# Altium schematic sheet DualLEDDriver.SchDoc
size A; SheetNumber: 2; SheetTotal: 2; SPICEModelCacheRFRFCTWC: <root> / <DocumentId>RFRFCTWC</DocumentId> / <CacheFrame Number="0"> / <Model Name="cap" Kind="MDL"> / <Text>*Default semiconductor capacitor / .MODEL CAP C()</Text> / </Model> / </CacheFrame> / </root>
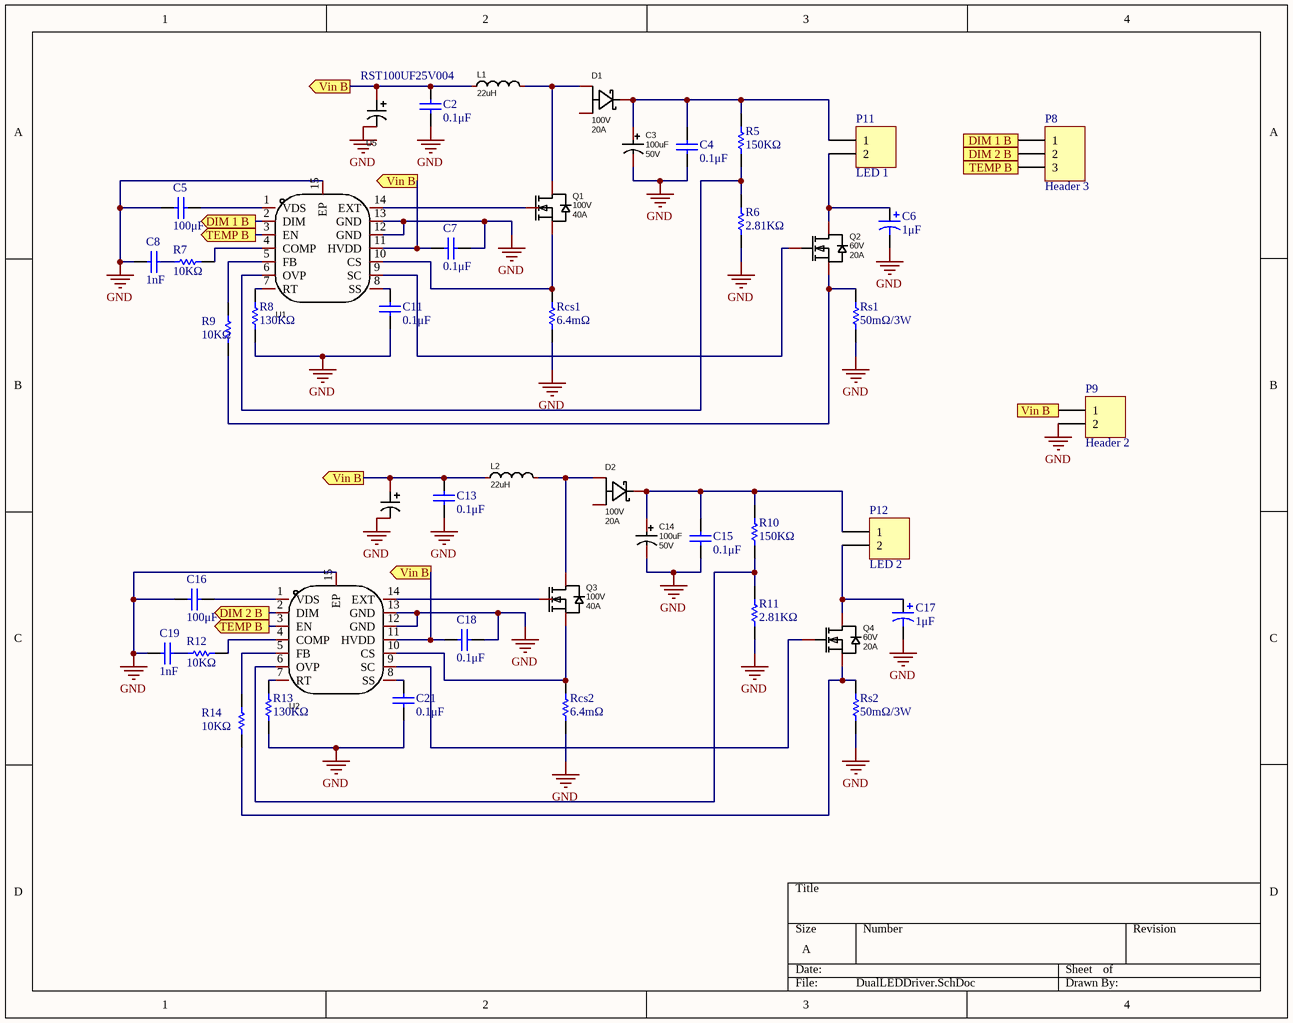
[diagram p0: DualLEDDriver.SchDoc]

## Parts
C2  value 0.1μF  [C0805]  (hidden comment: Cap)
C3  value 100uF  Rated Voltage: 50V  [CAP-TH_BD8.0-P3.50-D0.6-FD]  (hidden comment: KM107M050F12RR0VH2FP0)
C4  value 0.1μF  [C0805]  (hidden comment: Cap)
C5  value 100μF  [C0805]  (hidden comment: Cap)
C6  value 1μF  [C0805]  (hidden comment: Cap Pol3)
C7  value 0.1μF  [C0805]  (hidden comment: Cap)
C8  value 1nF  [C0805]  (hidden comment: Cap)
C11  value 0.1μF  [C0805]  (hidden comment: Cap)
C13  value 0.1μF  [C0805]  (hidden comment: Cap)
C14  value 100uF  Rated Voltage: 50V  [CAP-TH_BD8.0-P3.50-D0.6-FD]  (hidden comment: KM107M050F12RR0VH2FP0)
C15  value 0.1μF  [C0805]  (hidden comment: Cap)
C16  value 100μF  [C0805]  (hidden comment: Cap)
C17  value 1μF  [C0805]  (hidden comment: Cap Pol3)
C18  value 0.1μF  [C0805]  (hidden comment: Cap)
C19  value 1nF  [C0805]  (hidden comment: Cap)
C21  value 0.1μF  [C0805]  (hidden comment: Cap)
D1  Reverse Voltage (Vr): 100V  Average Rectified Current (Io): 20A  [TO-277_3P-L5.7-W4.2-LS6.5-BR]  (hidden comment: ST20100L)
D2  Reverse Voltage (Vr): 100V  Average Rectified Current (Io): 20A  [TO-277_3P-L5.7-W4.2-LS6.5-BR]  (hidden comment: ST20100L)
L1  value 22uH  [IND-SMD_L16.5-W15.5]  (hidden comment: FEXL1513A-220M)
L2  value 22uH  [IND-SMD_L16.5-W15.5]  (hidden comment: FEXL1513A-220M)
P8  Header 3  [HDR1X3]
P9  Header 2  [HDR1X2]
P11  LED 1  [HDR1X2]
P12  LED 2  [HDR1X2]
Q1  Drain Source Voltage (Vdss): 100V  Continuous Drain Current (Id): 40A  [TO-252-2_L6.6-W6.1-P4.58-LS9.9-TL]  (hidden comment: AP40T10GH-VB)
Q2  Drain Source Voltage (Vdss): 60V  Continuous Drain Current (Id): 20A  [TO-252-2_L6.6-W6.1-P4.57-LS10.1-TL-CW]  (hidden comment: NCE6020AK)
Q3  Drain Source Voltage (Vdss): 100V  Continuous Drain Current (Id): 40A  [TO-252-2_L6.6-W6.1-P4.58-LS9.9-TL]  (hidden comment: AP40T10GH-VB)
Q4  Drain Source Voltage (Vdss): 60V  Continuous Drain Current (Id): 20A  [TO-252-2_L6.6-W6.1-P4.57-LS10.1-TL-CW]  (hidden comment: NCE6020AK)
R5  value 150KΩ  [C0805]  (hidden comment: Res1)
R6  value 2.81KΩ  [C0805]  (hidden comment: Res1)
R7  value 10KΩ  [C0805]  (hidden comment: Res1)
R8  value 130KΩ  [C0805]  (hidden comment: Res1)
R9  value 10KΩ  [C0805]  (hidden comment: Res1)
R10  value 150KΩ  [C0805]  (hidden comment: Res1)
R11  value 2.81KΩ  [C0805]  (hidden comment: Res1)
R12  value 10KΩ  [C0805]  (hidden comment: Res1)
R13  value 130KΩ  [C0805]  (hidden comment: Res1)
R14  value 10KΩ  [C0805]  (hidden comment: Res1)
Rcs1  value 6.4mΩ  [C0805]  (hidden comment: Res1)
Rcs2  value 6.4mΩ  [C0805]  (hidden comment: Res1)
Rs1  value 50mΩ/3W  [C2512]  (hidden comment: Res1)
Rs2  value 50mΩ/3W  [C2512]  (hidden comment: Res1)
U1  FP7209mR-G1  [TSSOP-14_L5.0-W4.4-P0.65-LS6.4-BL-EP]  (value not drawn)
U2  FP7209mR-G1  [TSSOP-14_L5.0-W4.4-P0.65-LS6.4-BL-EP]  (value not drawn)
U5  RST100UF25V004  [CAP-SMD_BD6.3-L6.6-W6.6-LS7.3-FD]
U6  RST100UF25V004  [CAP-SMD_BD6.3-L6.6-W6.6-LS7.3-FD]  (value not drawn)

## Ports
DIM 1 B (in), DIM 1 B (out), DIM 2 B (in), DIM 2 B (out), TEMP B (in), TEMP B (out), Vin B (out)

## Nets
GND: C2.1 C3.2 C4.1 C5.2 C6.2 C7.1 C8.2 C11.1 C13.1 C14.2 C15.1 C16.2 C17.2 C18.1 C19.2 C21.1 P9.2 R6.2 R8.1 R11.2 R13.1 Rcs1.1 Rcs2.1 Rs1.1 Rs2.1 U1.12(GND) U1.13(GND) U1.15(EP) U2.12(GND) U2.13(GND) U2.15(EP) U5.2 U6.2
DIM 1 B: P8.1 U1.2(DIM) ; port DIM 1 B
DIM 2 B: P8.2 U2.2(DIM) ; port DIM 2 B
TEMP B: P8.3 U1.3(EN) U2.3(EN) ; port TEMP B
Vin B: C2.2 C7.2 C13.2 C18.2 L1.2 L2.2 P9.1 U1.11(HVDD) U2.11(HVDD) U5.1 U6.1 ; port Vin B
NetC3_1: C3.1 C4.2 D1.2(K) P11.1 R5.2
NetC5_1: C5.1 U1.1(VDS)
NetC6_1: C6.1 P11.2 Q2.2(D)
NetC8_1: C8.1 R7.1
NetC11_2: C11.2 U1.8(SS)
NetC14_1: C14.1 C15.2 D2.2(K) P12.1 R10.2
NetC16_1: C16.1 U2.1(VDS)
NetC17_1: C17.1 P12.2 Q4.2(D)
NetC19_1: C19.1 R12.1
NetC21_2: C21.2 U2.8(SS)
NetD1_1: D1.1(A) L1.1 Q1.2(D)
NetD2_1: D2.1(A) L2.1 Q3.2(D)
NetQ1_1: Q1.1(G) U1.14(EXT)
NetQ1_3: Q1.3(S) Rcs1.2 U1.10(CS)
NetQ2_1: Q2.1(G) U1.9(SC)
NetQ2_3: Q2.3(S) R9.1 Rs1.2
NetQ3_1: Q3.1(G) U2.14(EXT)
NetQ3_3: Q3.3(S) Rcs2.2 U2.10(CS)
NetQ4_1: Q4.1(G) U2.9(SC)
NetQ4_3: Q4.3(S) R14.1 Rs2.2
NetR5_1: R5.1 R6.1 U1.6(OVP)
NetR7_2: R7.2 U1.4(COMP)
NetR8_2: R8.2 U1.7(RT)
NetR9_2: R9.2 U1.5(FB)
NetR10_1: R10.1 R11.1 U2.6(OVP)
NetR12_2: R12.2 U2.4(COMP)
NetR13_2: R13.2 U2.7(RT)
NetR14_2: R14.2 U2.5(FB)

Not connected (* = marked no-connect by the designer): D1 3(A); D2 3(A)

## Library data of the parts
C2 C4 C5 C7 C8 C11 C13 C15 C16 C18 C19 C21 = Cap: Capacitor; Published: 8-Jun-2000; LatestRevisionDate: 17-Jul-2002; LatestRevisionNote: Re-released for DXP Platform.; PackageReference: RAD-0.3; Publisher: Altium Limited; PackageDescription: Radial Cap, Thru-Hole; 2 Leads; 0.3 in Pin Spacing
C3 C14 = KM107M050F12RR0VH2FP0: Manufacturer: CX(承兴); Symbol: 50V 100uF 8X12; Add into BOM: yes; Tolerance: ±20%; φD: 8mm; L: 12mm; Lifetime @ Temp: 2000hrs@105℃; Device: KM107M050F12RR0VH2FP0; LCSC Part Name: 100uF ±20% 50V; Supplier Part: C2749; Manufacturer Part: KM107M050F12RR0VH2FP0; Supplier Footprint: 插件,D8xL12mm; JLCPCB Part Class: Extended Part; Datasheet: https://atta.szlcsc.com/upload/public/pdf/source/20211027/06D6BA3719C264B639DC286D935D03EA.pdf; Supplier: LCSC; Convert to PCB: yes; Lead Spacing: 3.5mm
C6 C17 = Cap Pol3: Polarized Capacitor (Surface Mount); Published: 8-Jun-2000; LatestRevisionDate: 29-May-2009; LatestRevisionNote: IPC-7351 Footprint Added.; PackageReference: C0805; Publisher: Altium Limited; PackageDescription: Chip Capacitor
D1 D2 = ST20100L: Manufacturer: CJ(江苏长电/长晶); Add into BOM: yes; Diode Configuration: 独立式; Forward Voltage (Vf@If): 650mV@20A; Reverse Leakage Current (Ir): 30uA@100V; Symbol: ST20100L; Device: ST20100L; LCSC Part Name: 电压:100V 电流:20A; Supplier Part: C2693410; Manufacturer Part: ST20100L; Supplier Footprint: TO-277; JLCPCB Part Class: Extended Part; Datasheet: https://atta.szlcsc.com/upload/public/pdf/source/20210330/C2693410_9551F5ED840A67394421895091158B3C.pdf; Supplier: LCSC; Convert to PCB: yes
L1 L2 = FEXL1513A-220M: Manufacturer: cjiang(长江微电); Add into BOM: yes; Tolerance: ±20%; Rated Current: 17A; Saturation Current (Isat): 22A; DC Resistance (DCR): 13.86mΩ; Type: 一体成型电感; Symbol: FEXL1513A-220M; Device: FEXL1513A-220M; LCSC Part Name: 22uH ±20% 22A; Supplier Part: C5378604; Manufacturer Part: FEXL1513A-220M; Supplier Footprint: SMD,16.5x15.5x12.7mm(1513); JLCPCB Part Class: Extended Part; Datasheet: https://atta.szlcsc.com/upload/public/pdf/source/20230406/FF57C09F52BFC355BADE8D0321BD05F5.pdf; Supplier: LCSC; Convert to PCB: yes; Ratings: AEC-Q200
P8 = Header 3: Header, 3-Pin; LatestRevisionDate: 17-Jul-2002; LatestRevisionNote: Re-released for DXP Platform.; Publisher: Altium Limited
P9 P11 P12 = Header 2: Header, 2-Pin; LatestRevisionDate: 17-Jul-2002; LatestRevisionNote: Re-released for DXP Platform.; Publisher: Altium Limited
Q1 Q3 = AP40T10GH-VB: Manufacturer: VBsemi(微碧半导体); Add into BOM: yes; Type: N沟道; Drain Source On Resistance (RDS(on)@Vgs,Id): 30mΩ@10V,40A; Symbol: AP40T10GH; Device: AP40T10GH-VB; LCSC Part Name: N沟道 耐压:100V 电流:40A; Supplier Part: C693118; Manufacturer Part: AP40T10GH-VB; Supplier Footprint: TO-252-2; JLCPCB Part Class: Extended Part; Datasheet: https://atta.szlcsc.com/upload/public/pdf/source/20230505/1A0FD829F773C85C90E545D17A9CBDF0.pdf; Supplier: LCSC; Convert to PCB: yes; Power Dissipation (Pd): -; Gate Threshold Voltage (Vgs(th)@Id): -; Total Gate Charge (Qg@Vgs): -; Input Capacitance (Ciss@Vds): -; Reverse Transfer Capacitance (Crss@Vds): -
Q2 Q4 = NCE6020AK: Manufacturer: NCE(无锡新洁能); Add into BOM: yes; Type: N沟道; Power Dissipation (Pd): 45W; Drain Source On Resistance (RDS(on)@Vgs,Id): 35mΩ@10V,20A; Gate Threshold Voltage (Vgs(th)@Id): 2.5V@250uA; Symbol: NCE6020AK; Device: NCE6020AK; LCSC Part Name: N沟道 耐压:60V 电流:20A; Supplier Part: C108639; Manufacturer Part: NCE6020AK; Supplier Footprint: TO-252-2(DPAK); JLCPCB Part Class: Extended Part; Datasheet: https://atta.szlcsc.com/upload/public/pdf/source/20231201/F7F8CF8E769EE35C01C69D8E45471040.pdf; Supplier: LCSC; Convert to PCB: yes
R5-R14 Rcs1 Rcs2 Rs1 Rs2 = Res1: Resistor; Published: 8-Jun-2000; LatestRevisionDate: 17-Jul-2002; LatestRevisionNote: Re-released for DXP Platform.; PackageReference: AXIAL-0.3; Publisher: Altium Limited; PackageDescription: Axial Device, Thru-Hole; 2 Leads; 0.3 in Pin Spacing
U1 U2 = FP7209mR-G1: Manufacturer: Advanced Analog Technology(类比); Add into BOM: yes; Symbol: FP7209MR-G1; Device: FP7209mR-G1; LCSC Part Name: FP7209mR-G1; Supplier Part: C2762848; Manufacturer Part: FP7209mR-G1; Supplier Footprint: TSSOP-14-EP; JLCPCB Part Class: Extended Part; Datasheet: https://atta.szlcsc.com/upload/public/pdf/source/20210915/BA17F30BBB4CEE378D5F258F3F58057A.pdf; Supplier: LCSC; Convert to PCB: yes
U5 U6 = RST100UF25V004: Manufacturer: KNSCHA(科尼盛); Add into BOM: yes; Value: 100uF; Tolerance: ±20%; Rated Voltage: 25V; Ripple Current: 88mA@120Hz; φD: 6.3mm; L: 5.4mm; Lifetime @ Temp: 2000hrs@105℃; Symbol: RST100UF25V004; Device: RST100UF25V004; LCSC Part Name: 100uF ±20% 25V; Supplier Part: C4747964; Manufacturer Part: RST100UF25V004; Supplier Footprint: SMD,D6.3xL5.4mm; JLCPCB Part Class: Extended Part; Datasheet: https://atta.szlcsc.com/upload/public/pdf/source/20220722/52F6C209ACF875FF59C64C72CE2329EE.pdf; Supplier: LCSC; Convert to PCB: yes; Equivalent Series Resistance(ESR): -; Operating Temperature: -40℃~+105℃